# EAGLE design tiretempdaq (EAGLE 7.5.0)

## Sheet 1 of 2
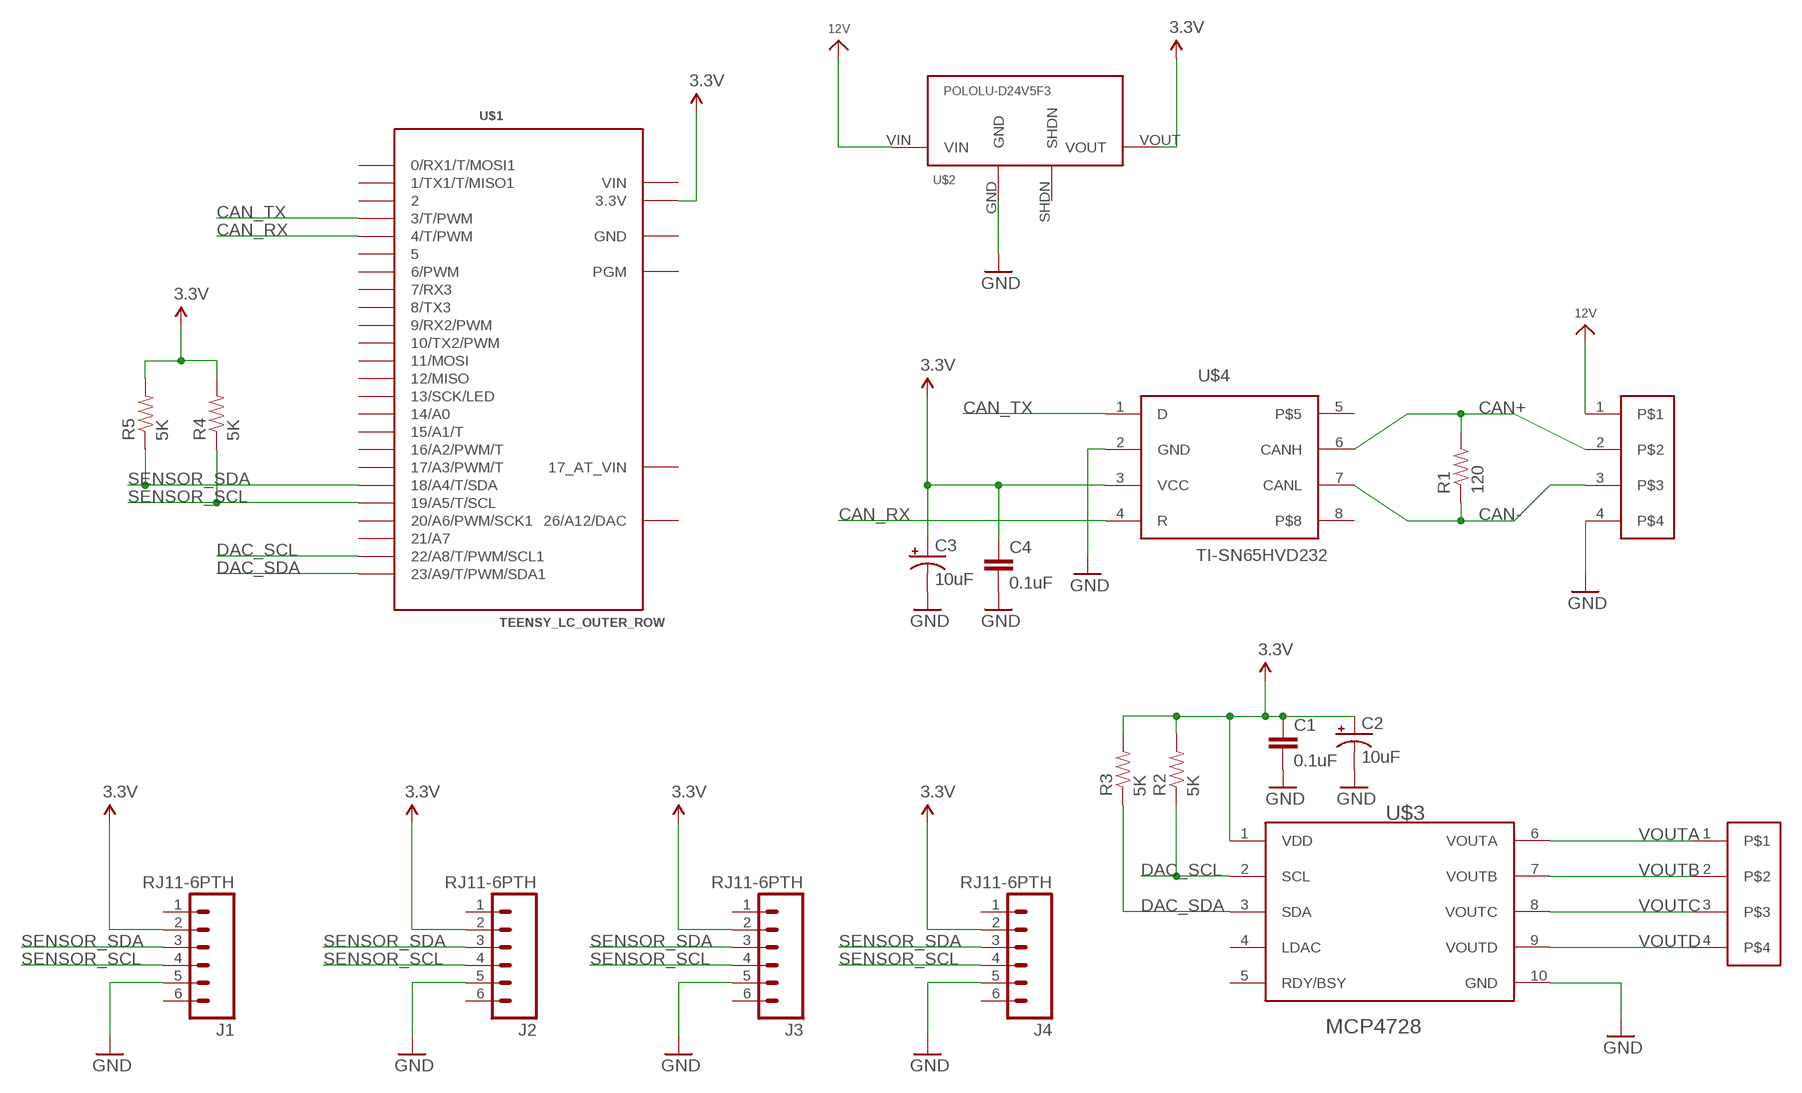
[diagram p0: schematic, sheet 1]

### Parts
C1  0.1uF  0.1UF-25V-5%(0603)  [0603-CAP]
C2  10uF  10UF-16V-10%(TANT)  [EIA3216]
C3  10uF  10UF-16V-10%(TANT)  [EIA3216]
C4  0.1uF  0.1UF-25V-5%(0603)  [0603-CAP]
J1  RJ11-6PTH  [RJ11-6]
J2  RJ11-6PTH  [RJ11-6]
J3  RJ11-6PTH  [RJ11-6]
J4  RJ11-6PTH  [RJ11-6]
J5  TERM-BLOCK-P4-3.5OST-TE-3.5-4P  [TERM-4P-3.5]
J6  TERM-BLOCK-P4-3.5OST-TE-3.5-4P  [TERM-4P-3.5]
R1  120  RESISTOR0805-RES  [0805]
R2  5K  RESISTOR0805-RES  [0805]
R3  5K  RESISTOR0805-RES  [0805]
R4  5K  RESISTOR0805-RES  [0805]
R5  5K  RESISTOR0805-RES  [0805]
U$1  TEENSY_LC_OUTER_ROW  [TEENSY3-OUTER_ROW]
U$2  POLOLU-D24V5F3  POLOLU-DC-4PIND24V5FX  [POLOLU-DC-4PIN]
U$3  MCP4728  [MSOP-10]
U$4  TI-SN65HVD232  [SOIC8]

### Nets
3.3V: C1.1 C2.A(+) C3.A(+) C4.1 J1.2 J2.2 J3.2 J4.2 R2.2 R3.2 R4.2 R5.2 U$1.3.3V U$1.3.3V1(3.3V) U$2.VOUT U$3.1(VDD) U$4.3(VCC)
12V: J5.1 U$2.VIN
CAN+: J5.2 R1.2 U$4.6(CANH)
CAN-: J5.3 R1.1 U$4.7(CANL)
CAN_RX: U$1.4(4/T/PWM) U$4.4(R)
CAN_TX: U$1.3(3/T/PWM) U$4.1(D)
DAC_SCL: R2.1 U$1.22/A8(22/A8/T/PWM/SCL1) U$3.2(SCL)
DAC_SDA: R3.1 U$1.23/A9(23/A9/T/PWM/SDA1) U$3.3(SDA)
GND: C1.2 C2.C(-) C3.C(-) C4.2 J1.5 J2.5 J3.5 J4.5 J5.4 U$2.GND U$3.10(GND) U$4.2(GND)
SENSOR_SCL: J1.4 J2.4 J3.4 J4.4 R4.1 U$1.19/A5(19/A5/T/SCL)
SENSOR_SDA: J1.3 J2.3 J3.3 J4.3 R5.1 U$1.18/A4(18/A4/T/SDA)
VOUTA: J6.1 U$3.6(VOUTA)
VOUTB: J6.2 U$3.7(VOUTB)
VOUTC: J6.3 U$3.8(VOUTC)
VOUTD: J6.4 U$3.9(VOUTD)
Unconnected: J1.1 J1.6 J2.1 J2.6 J3.1 J3.6 J4.1 J4.6 U$1.0(0/RX1/T/MOSI1) U$1.1(1/TX1/T/MISO1) U$1.2 U$1.5 U$1.6(6/PWM) U$1.7(7/RX3) U$1.8(8/TX3) U$1.9(9/RX2/PWM) U$1.10(10/TX2/PWM) U$1.11(11/MOSI) U$1.12(12/MISO) U$1.13(13/SCK/LED) U$1.14/A0 U$1.15/A1(15/A1/T) U$1.16/A2(16/A2/PWM/T) U$1.17/A3(17/A3/PWM/T) U$1.20/A6(20/A6/PWM/SCK1) U$1.21/A7 U$1.PGM U$1.VBAT(17_AT_VIN) U$2.SHDN U$3.4(LDAC) U$3.5(RDY/BSY) U$4.5 U$4.8

## Sheet 2 of 2

## Power pins joined to a net without a drawn wire
26/A12/DAC: U$1.RESET/DAC(26/A12/DAC)
GND: U$1.AGND(GND) U$1.GND U$1.GND1(GND)
VIN: U$1.VIN

## Library data of the parts
C1 C4 = SparkFun-Capacitors:0.1UF-25V-5%(0603): CAP-08604; PROD_ID: CAP-08604
C2 C3 = SparkFun-Capacitors:10UF-16V-10%(TANT): CAP-00811 1206/EIA-3216 Tantalum capacitor; PROD_ID: CAP-00811
J1-J4 = synfinatic:RJ11-6: RJ11 Jack Simple 6 pin RJ11 jack. Commonly found on CAT3 devices and Microchip programmers. SKU: PRT-00132 AKA: Assmann WSW Components A-2004-0-4-LP-N-R http://www.digikey.com/scripts/DkSearch/dksus.dll?Detail&itemSeq=188493072&uq=635893574606648195
J5 J6 = synfinatic:TERM-BLOCK-P4-3.5: Phoenix Terminal Block 3.5mm x 4 PTSA 1.5/ 4-3.5-F http://www.digikey.com/product-detail/en/1984989/277-6404-ND/2513979 OST TE 3.5mm Series: http://www.digikey.com/scripts/DkSearch/dksus.dll?Detail&itemSeq=188344160&uq=635891673386773522
R1-R5 = SparkFun-Passives:RESISTOR: Resistor Basic schematic elements and footprints for 0603, 1206, and PTH resistors.
U$1 = Teensy_3_and_LC_Series_Boards_v1.1:TEENSY_LC_OUTER_ROW: Teensy LC with only outer row of pins.
U$2 = synfinatic:POLOLU-DC-4PIN: Pololu 4 Pin DC/DC Conveters @ 0.4" x 0.5" D24V5Fx D24V6Fx
U$3 = synfinatic:MCP4728: MCP4728 4ch DAC in 10-MSOP Useful in 3.3 and 5V environments!
U$4 = synfinatic:TI-SN65HVD232: TI SN65HVD232 CANBus Transceiver http://www.digikey.com/scripts/DkSearch/dksus.dll?Detail&itemSeq=188339824&uq=635893531929248804

## Board
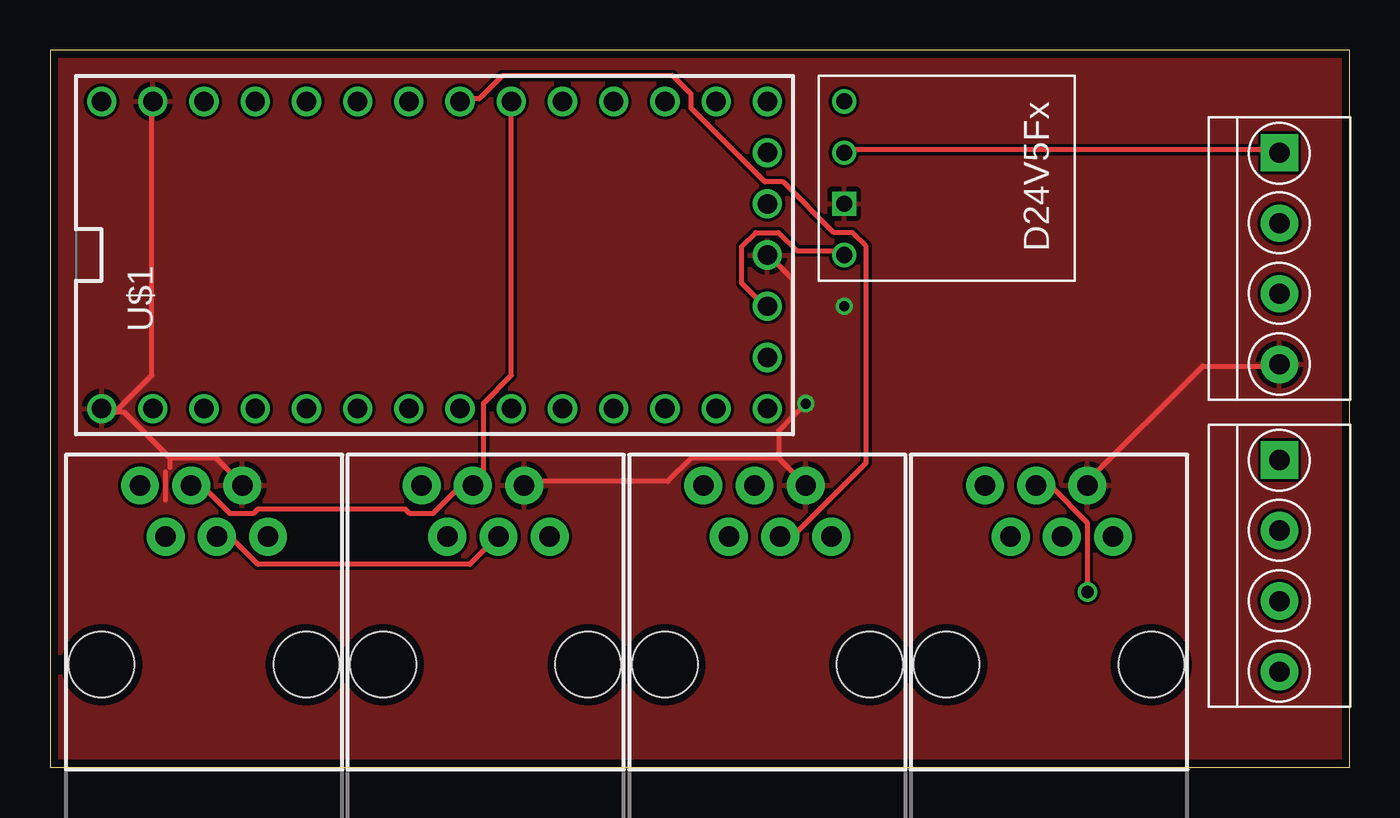
[diagram p1: board, top side]
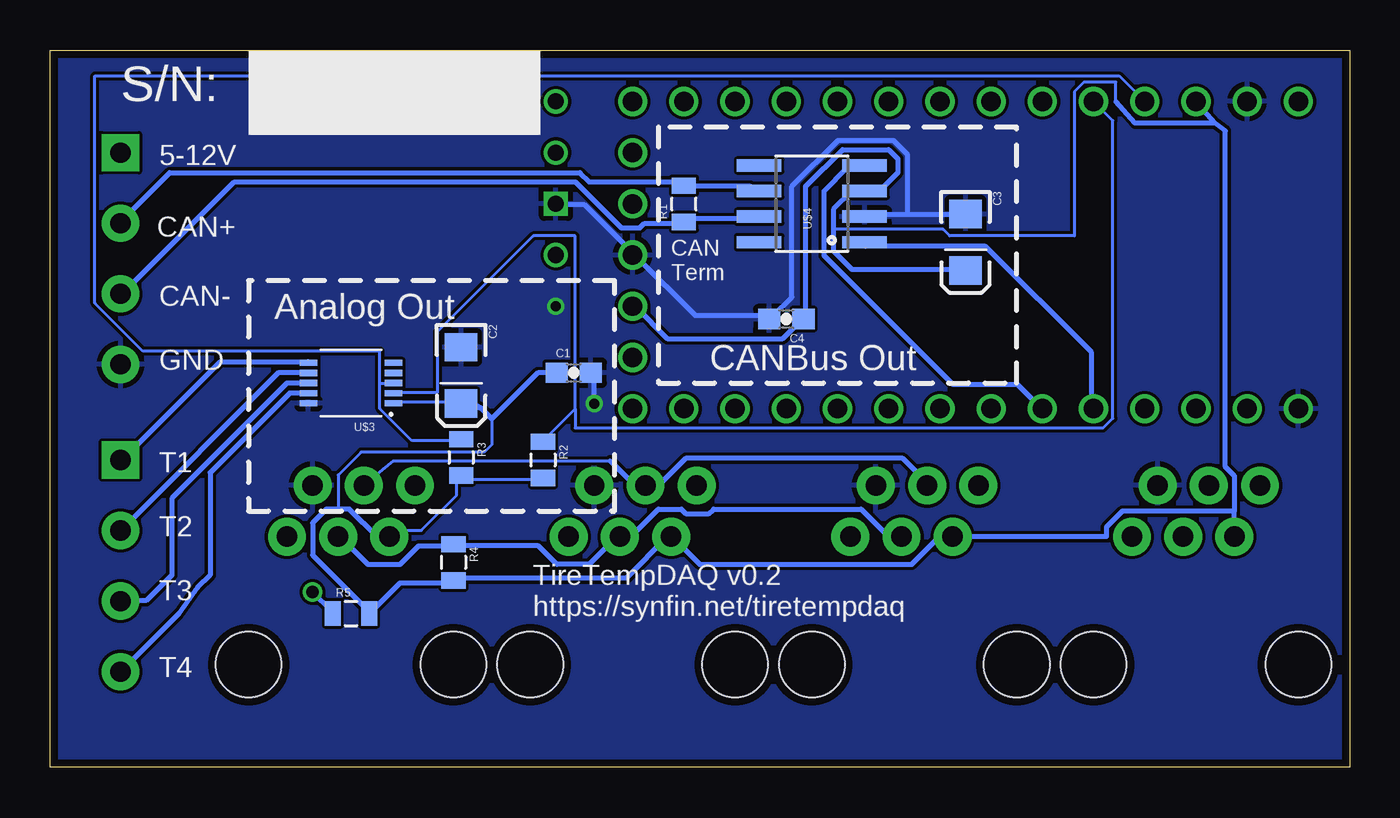
[diagram p2: board, bottom side, seen from below]

Size 64.44 x 35.55 mm. Coordinates in mm from the lower left corner, seen from the top.
Outline: 0,0 64.44,0 64.44,35.55 0,35.55 0,0
Copper layers (1*16): Top 0.0356mm / dielectric 1.5011mm / Bottom 0.0356mm
Design rules "LaenPCBOrder": minimum track width 6mil, minimum drill 13mil, track to track 6mil, track to pad 6mil, pad to pad 6mil, via to via 6mil, smd to smd 6mil, copper to edge 15mil, drill to drill 6mil, minimum pad ring 7mil, minimum via ring 7mil, stop-mask expansion 4mil, vias tented up to drill 0mil, thermal gap 10mil

### Footprints (pad centres in the part's own frame; a part is rotated, then mirrored left to right if it is on the bottom)
0603-CAP = smd 1.1 x 1: 1 -0.85,0; 2 0.85,0
EIA3216 = smd 1.4 x 1.6: A 1.4,0; C -1.4,0
RJ11-6 = drill 1.016 pad 1.88: 1 1.905,8.89; 2 3.175,6.35; 3 4.445,8.89; 4 5.715,6.35; 5 6.985,8.89; 6 8.255,6.35 | hole 3.251: 0,0; 10.16,0
TERM-4P-3.5 = drill 1 pad 1.85 square: 1 0.005,0 | drill 1 pad 1.85: 2 3.505,0; 3 7.005,0; 4 10.505,0
0805 = smd 0.8 x 1.2: 1 -0.9,0; 2 0.9,0
TEENSY3-OUTER_ROW = drill 0.965: 0 -7.62,13.97; 1 -7.62,11.43; 2 -7.62,8.89; 3 -7.62,6.35; 3.3V 7.62,11.43; 3.3V1 -2.54,-16.51; 4 -7.62,3.81; 5 -7.62,1.27; 6 -7.62,-1.27; 7 -7.62,-3.81; 8 -7.62,-6.35; 9 -7.62,-8.89; 10 -7.62,-11.43; 11 -7.62,-13.97; 12 -7.62,-16.51; 13 7.62,-16.51; 14/A0 7.62,-13.97; 15/A1 7.62,-11.43; 16/A2 7.62,-8.89; 17/A3 7.62,-6.35; 18/A4 7.62,-3.81; 19/A5 7.62,-1.27; 20/A6 7.62,1.27; 21/A7 7.62,3.81; 22/A8 7.62,6.35; 23/A9 7.62,8.89; AGND 7.62,13.97; GND -7.62,16.51; GND1 0,-16.51; PGM 2.54,-16.51; RESET/DAC 5.08,-16.51; VBAT -5.08,-16.51; VIN 7.62,16.51
POLOLU-DC-4PIN = drill 0.8 square: GND 6.35,1.27 | drill 0.8: SHDN 1.27,1.27; VIN 3.81,1.27; VOUT 8.89,1.27
MSOP-10 = smd 0.305 x 0.889: 1 -1,-2.11; 2 -0.5,-2.11; 3 0,-2.11; 4 0.5,-2.11; 5 1,-2.11; 6 1,2.11; 7 0.5,2.11; 8 0,2.11; 9 -0.5,2.11; 10 -1,2.11
SOIC8 = smd 0.61 x 2.21: 1 -1.905,-2.616; 2 -0.635,-2.616; 3 0.635,-2.616; 4 1.905,-2.616; 5 1.905,2.616; 6 0.635,2.616; 7 -0.635,2.616; 8 -1.905,2.616

### Placement (x,y rotation side)
C1  38.48,19.56 0 bottom
C2  44.07,19.43 270 bottom
C3  19.05,26.04 270 bottom
C4  27.94,22.23 180 bottom
J1  2.54,5.08 0 top
J2  16.51,5.08 0 top
J3  30.48,5.08 0 top
J4  44.45,5.08 0 top
J5  60.96,30.48 270 top
J6  60.96,15.24 270 top
R1  33.02,27.94 90 bottom
R2  40.01,15.24 270 bottom
R3  44.07,15.37 270 bottom
R4  44.45,10.16 270 bottom
R5  49.53,7.62 0 bottom
U$1  19.05,25.4 90 top
U$2  38.1,34.29 270 top
U$3  49.53,19.05 90 bottom
U$4  26.67,27.94 90 bottom

### Tracks (layer width: path | path; a pad name or v marks a point on that pad's centre or on a via)
3.3V
  Top 0.254: U$2.VOUT 39.32,25.6 37.03,25.6 36.12,26.52 34.98,26.52 34.29,25.83 34.29,24 35.43,22.86 U$1.3.3V1
  Bottom 0.152: U$3.1 47.31,18.1 44.13,18.1 C2.A | 43.18,17.94 43.2,17.83 | R2.2 40.01,14.29 43.97,14.29 R3.2 44.13,14.29 44.29,14.13 44.29,13.49 46.04,11.75 47.62,11.75 J4.2 | 25.6,26.67 20.16,26.67 19.84,26.35 13.65,26.35 13.65,33.5 13.18,33.97 11.59,33.97 11.59,33.02 | 42.55,17.27 42.55,16 42.93,15.62 49.02,15.62 50.16,14.48 50.16,12.8
  Bottom 0.254: C3.A 19.2,24.69 24.69,24.69 25.6,25.6 25.6,26.67 25.6,27.66 24.69,28.57 U$4.3 23.32,28.57 22.4,29.49 22.4,30.18 22.86,30.63 25.15,30.63 26.98,28.8 26.98,22.4 C4.1 27.2,22.17 28.12,21.26 33.83,21.26 35.43,22.86 U$1.3.3V1 | 43.2,17.83 43.43,18.06 | 47.32,18.06 U$3.1 | 43.2,17.83 C2.A | J4.2 48.23,11.43 49.61,12.8 50.16,12.8 50.75,12.8 51.44,12.12 51.44,10.52 48.69,7.77 R5.2 48.46,7.77 47.09,9.14 44.58,9.14 R4.2 44.35,9.37 35.89,9.37 33.83,11.43 J3.2 33.6,11.43 32.23,10.06 21.72,10.06 20.34,11.43 J2.2 12.06,11.43 12.06,11.91 11.27,12.7 5.71,12.7 | 6.67,31.94 6.16,31.56 6.16,14.89 5.71,14.45 5.71,12.7 | 6.67,31.94 U$1.3.3V | J1.2 5.71,12.7 | 11.59,33.02 10.64,31.94 6.67,31.94 | 43.2,17.83 43.1,17.83 42.55,17.27 40.26,19.56 C1.1
12V
  Top 0.254: U$2.VIN 39.55,30.63 60.81,30.63 J5.1
CAN+
  Bottom 0.254: U$4.6 29.49,28.57 29.72,28.8 32.92,28.8 R1.2 33.15,29.03 37.72,29.03 38.18,29.49 58.52,29.49 60.81,27.2 J5.2
CAN-
  Bottom 0.254: U$4.7 29.49,27.2 32.92,27.2 R1.1 33.15,26.98 34.98,26.98 35.2,26.75 36.12,26.75 38.41,29.03 55.32,29.03 60.81,23.55 J5.3
CAN_RX
  Bottom 0.254: U$4.4 24.23,29.72 24.92,29.72 26.06,28.57 26.06,25.38 19.66,18.97 16.46,18.97 15.32,17.83 U$1.4
CAN_TX
  Bottom 0.254: U$4.1 24,25.83 18.06,25.83 12.8,20.57 12.8,17.83 U$1.3
DAC_SCL
  Bottom 0.152: 38.42,17.78 38.42,26.35 40.48,26.35 45.24,21.59 45.24,18.57 47.31,18.57 U$3.2 | 38.42,17.78 40.01,16.19 R2.1 | U$1.22/A8 11.75,32.07 11.75,17.3 12.22,16.83 38.42,16.83 38.42,17.78
DAC_SDA
  Bottom 0.152: 48.1,19.05 U$3.3 | 48.1,19.05 48.1,17.78 46.51,16.19 44.13,16.19 R3.1 | U$1.23/A9 11.43,34.29 62.23,34.29 62.23,23.02 59.85,20.64 48.1,20.64 48.1,19.05
GND  (via drill 0.5)
  Top 0.254: 3.2,17.6 3.66,17.6 5.94,15.32 | 3.2,17.6 2.74,17.6 U$1.GND 3.2,17.6 | 5.94,15.32 8.23,15.32 9.37,14.17 J1.5 | 3.2,17.6 5.03,19.43 5.03,32.92 U$1.AGND | J5.4 60.81,19.89 57.15,19.89 51.44,14.17 J4.5 | 36.12,15.32 31.77,15.32 30.63,14.17 23.55,14.17 J2.5 | J3.5 36.12,15.32 | 36.12,15.32 36.12,16.69 36.8,17.37 | 36.8,17.37 36.8,24.23 35.66,25.38 U$1.GND1 | 5.94,14.86 5.94,15.32 | 5.71,13.26 5.71,14.63 | 36.8,17.37 v37.47,18.03
  Bottom 0.254: 21.95,27.43 24,27.43 U$4.2 | 21.95,27.43 19.2,27.43 C3.C | U$2.GND 39.32,27.89 37.95,27.89 35.66,25.6 U$1.GND1 35.43,25.38 32.46,22.4 28.8,22.4 C4.2 28.57,22.4 27.66,23.32 27.66,28.8 25.38,31.09 22.63,31.09 21.95,30.4 21.95,27.43 | v37.47,18.03 37.47,19.39 C1.2
  other vias: 39.37,22.86
  pour Top: 0.38,35.05 64.01,35.05 64.01,0.13 0.38,0.13
  pour Bottom: 0.38,35.05 64.01,35.05 64.01,0.13 0.38,0.13
SENSOR_SCL
  Top 0.254: J1.4 8.91,11.43 10.29,10.06 20.8,10.06 22.17,11.43 J2.4 | J3.4 36.8,11.43 40.46,15.09 40.46,25.83 39.78,26.52 38.86,26.52 36.35,29.03 35.43,29.03 31.77,32.69 31.77,33.38 30.86,34.29 22.4,34.29 21.26,33.15 20.34,33.15 U$1.19/A5
  Bottom 0.254: J4.4 50.06,11.43 48.69,10.06 47.09,10.06 46.18,10.97 44.58,10.97 R4.1 44.35,10.97 40.23,10.97 39.32,10.06 37.72,10.06 36.35,11.43 J3.4 35.66,11.43 34.29,12.8 33.15,12.8 32.92,12.57 31.77,12.57 31.55,12.8 24.23,12.8 22.86,11.43 J2.4
SENSOR_SDA  (via drill 0.61)
  Top 0.254: v51.44,8.69 51.44,12.12 49.61,13.95 48.92,13.95 J4.3 | U$1.18/A4 22.86,19.43 21.49,18.06 21.49,14.63 21.03,14.17 J2.3 20.8,13.95 20.34,13.95 18.97,12.57 17.83,12.57 17.6,12.8 10.29,12.8 10.06,12.57 8.91,12.57 7.54,13.95 7.09,13.95 J1.3
  Bottom 0.152: 36.68,15.19 47.42,15.19 J4.3
  Bottom 0.254: v51.44,8.69 50.52,7.77 R5.1 | 36.68,15.19 35.66,14.17 34.98,14.17 J3.3 34.75,14.17 34.06,14.17 32.92,15.32 22.17,15.32 21.03,14.17 J2.3
VOUTA
  Bottom 0.254: U$3.6 51.66,20.12 56.01,20.12 60.81,15.32 J6.1
VOUTB
  Bottom 0.254: U$3.7 53.15,19.55 J6.2
VOUTC
  Bottom 0.254: U$3.8 52.7,19.05 58.42,13.34 58.42,9.53 59.69,8.26 60.94,8.26 J6.3
VOUTD
  Bottom 0.254: U$3.9 52.57,18.55 56.52,14.61 56.52,9.53 57.15,8.89 58.08,7.62 J6.4

### Text on the board
bPlace: 5-12V | CAN+ | CAN / Term | CAN- | Analog Out | CANBus Out | GND | T1 | T2 | T3 | TireTempDAQ v0.2 / https://synfin.net/tiretempdaq | T4
bNames: S/N: